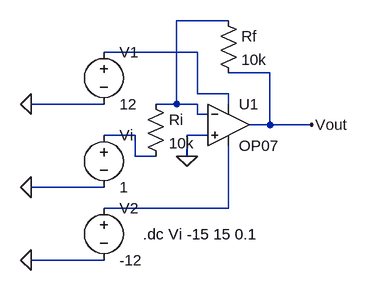
[diagram p0: schematic DC_gain.asc]
DC_gain.asc, the LTspice schematic file:
Version 4
SHEET 1 880 680
WIRE 192 0 112 0
WIRE 144 48 0 48
WIRE 256 80 192 80
WIRE 144 112 144 48
WIRE 192 112 144 112
WIRE 0 128 -112 128
WIRE 112 128 112 0
WIRE 112 128 80 128
WIRE 144 128 112 128
WIRE 192 128 192 112
WIRE 144 144 144 128
WIRE 160 144 144 144
WIRE 256 160 256 80
WIRE 256 160 224 160
WIRE 320 160 256 160
WIRE 48 176 0 176
WIRE 160 176 128 176
WIRE 48 208 48 176
WIRE 80 208 48 208
WIRE 128 208 128 176
WIRE 0 256 -112 256
WIRE 192 288 192 192
WIRE 192 288 0 288
WIRE 0 368 -112 368
FLAG 128 208 0
FLAG -112 128 0
FLAG -112 256 0
FLAG -112 368 0
FLAG 320 160 Vout
SYMBOL OpAmps\\OP07 192 96 R0
SYMATTR InstName U1
SYMBOL voltage 0 32 R0
WINDOW 123 0 0 Left 0
WINDOW 39 0 0 Left 0
SYMATTR InstName V1
SYMATTR Value 12
SYMBOL voltage 0 160 R0
WINDOW 123 0 0 Left 0
WINDOW 39 0 0 Left 0
SYMATTR InstName Vi
SYMATTR Value 1
SYMBOL voltage 0 272 R0
WINDOW 123 0 0 Left 0
WINDOW 39 0 0 Left 0
SYMATTR InstName V2
SYMATTR Value -12
SYMBOL res 176 -16 R0
SYMATTR InstName Rf
SYMATTR Value 10k
SYMBOL res 64 112 R0
SYMATTR InstName Ri
SYMATTR Value 10k
TEXT 60 328 Left 2 !.dc Vi -15 15 0.1

The netlist it stands for:
* DC_gain.asc
XU1 0 N001 N002 N004 Vout LT1001  ; OP07, pins In+ In- V+ V- OUT
V1 N002 0 12
Vi N003 0 1
V2 N004 0 -12
Rf N001 Vout 10k
Ri N001 N003 10k
.dc Vi -15 15 0.1
.lib LTC.lib
.backanno
.end